# EAGLE design core v1 (EAGLE 6.1)

## Sheet 1 of 3
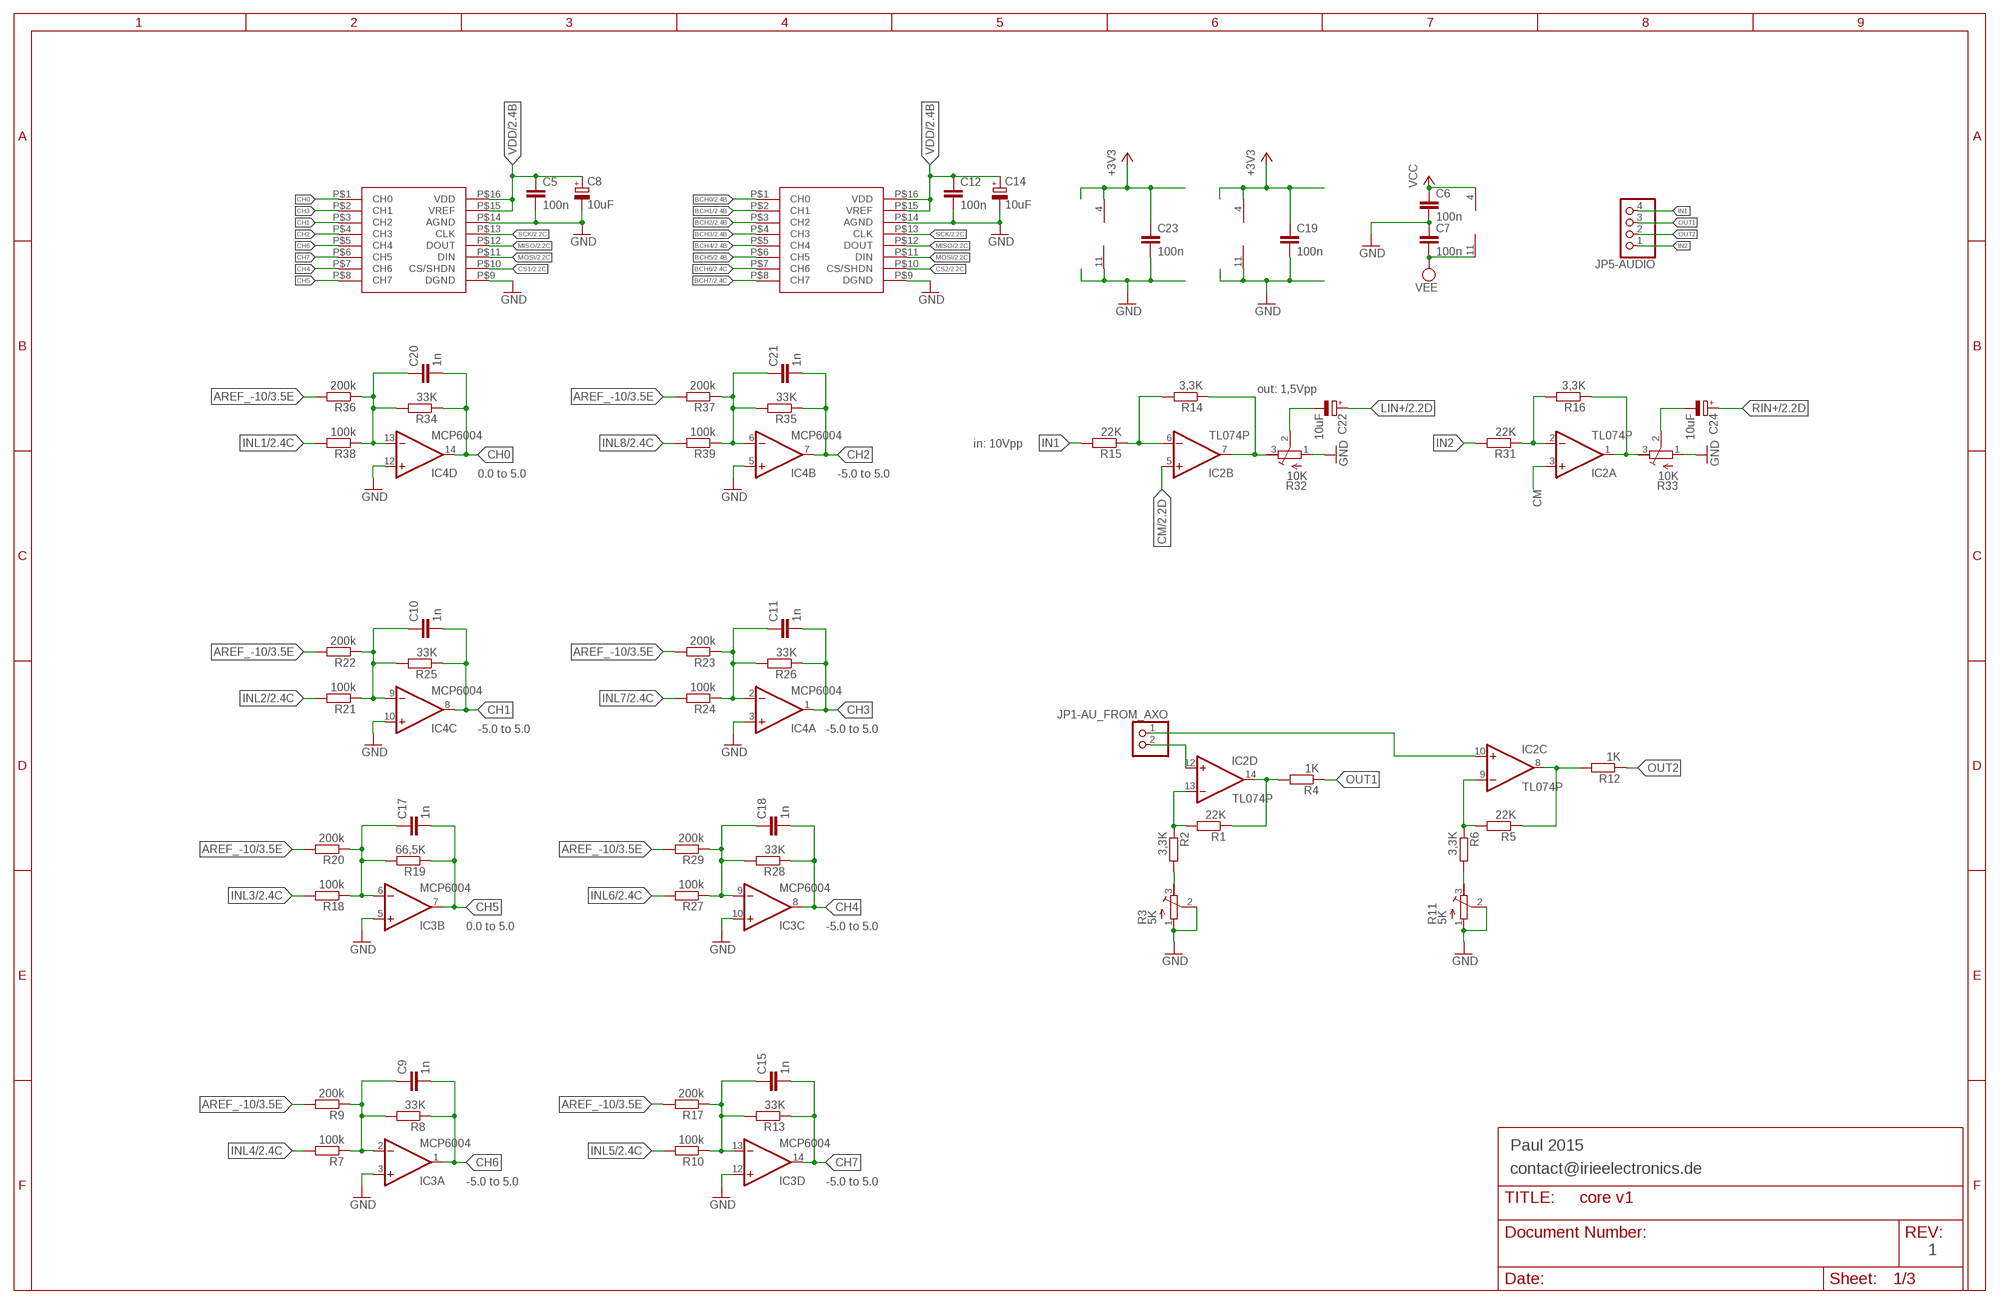
[diagram p0: schematic, sheet 1]

### Parts
C5  100n  C-EU025-025X050  [C025-025X050]
C6  100n  C-EU025-025X050  [C025-025X050]
C7  100n  C-EU025-025X050  [C025-025X050]
C8  10uF  CPOL-EUE1.8-4  [E1,8-4]
C9  1n  C-EU050-025X075  [C050-025X075]
C10  1n  C-EU050-025X075  [C050-025X075]
C11  1n  C-EU050-025X075  [C050-025X075]
C12  100n  C-EU025-025X050  [C025-025X050]
C14  10uF  CPOL-EUE1.8-4  [E1,8-4]
C15  1n  C-EU050-025X075  [C050-025X075]
C17  1n  C-EU050-025X075  [C050-025X075]
C18  1n  C-EU050-025X075  [C050-025X075]
C19  100n  C-EU025-025X050  [C025-025X050]
C20  1n  C-EU050-025X075  [C050-025X075]
C21  1n  C-EU050-025X075  [C050-025X075]
C22  10uF  CPOL-EUE1.8-4  [E1,8-4]
C23  100n  C-EU025-025X050  [C025-025X050]
C24  10uF  CPOL-EUE1.8-4  [E1,8-4]
IC2  TL074P  [DIL14]
IC3  MCP6004  TL074P  [DIL14]
IC4  MCP6004  TL074P  [DIL14]
JP1-AU_FROM_AXO  PINHD-1X2/90  [1X02/90]
JP5-AUDIO  PINHD-1X4_2.54  [1X04]
R1  22K  R-EU_0207/10  [0207/10]
R2  3,3K  R-EU_0207/12  [0207/12]
R3  5K  R-TRIMM3296P  [RTRIM3296P]
R4  1K  R-EU_0207/7  [0207/7]
R5  22K  R-EU_0207/7  [0207/7]
R6  3,3K  R-EU_0207/7  [0207/7]
R7  100k  R-EU_0207/7  [0207/7]
R8  33K  R-EU_0207/7  [0207/7]
R9  200k  R-EU_0207/10  [0207/10]
R10  100k  R-EU_0207/7  [0207/7]
R11  5K  R-TRIMM3296P  [RTRIM3296P]
R12  1K  R-EU_0207/10  [0207/10]
R13  33K  R-EU_0207/7  [0207/7]
R14  3,3K  R-EU_0207/7  [0207/7]
R15  22K  R-EU_0207/7  [0207/7]
R16  3,3K  R-EU_0207/7  [0207/7]
R17  200k  R-EU_0207/7  [0207/7]
R18  100k  R-EU_0207/7  [0207/7]
R19  66,5K  R-EU_0207/7  [0207/7]
R20  200k  R-EU_0207/10  [0207/10]
R21  100k  R-EU_0207/7  [0207/7]
R22  200k  R-EU_0207/7  [0207/7]
R23  200k  R-EU_0207/7  [0207/7]
R24  100k  R-EU_0207/10  [0207/10]
R25  33K  R-EU_0207/7  [0207/7]
R26  33K  R-EU_0207/7  [0207/7]
R27  100k  R-EU_0207/7  [0207/7]
R28  33K  R-EU_0207/7  [0207/7]
R29  200k  R-EU_0207/7  [0207/7]
R31  22K  R-EU_0207/7  [0207/7]
R32  10K  R-TRIMM3296P  [RTRIM3296P]
R33  10K  R-TRIMM3296P  [RTRIM3296P]
R34  33K  R-EU_0207/7  [0207/7]
R35  33K  R-EU_0207/7  [0207/7]
R36  200k  R-EU_0207/7  [0207/7]
R37  200k  R-EU_0207/7  [0207/7]
R38  100k  R-EU_0207/7  [0207/7]
R39  100k  R-EU_0207/7  [0207/7]
U$4  MCP3208_DIP  [MCP2308]
U$5  MCP3208_DIP  [MCP2308]

### Nets
+3V3: C19.1 C23.1 IC3.4(P:V+) IC4.4(P:V+) ; also sheet 2
AREF_-10: R9.2 R17.2 R20.2 R22.2 R23.2 R29.2 R36.2 R37.2 ; also sheet 3
BCH0: U$5.P$1(CH0) ; also sheet 2
BCH1: U$5.P$2(CH1) ; also sheet 2
BCH2: U$5.P$3(CH2) ; also sheet 2
BCH3: U$5.P$4(CH3) ; also sheet 2
BCH4: U$5.P$5(CH4) ; also sheet 2
BCH5: U$5.P$6(CH5) ; also sheet 2
BCH6: U$5.P$7(CH6) ; also sheet 2
BCH7: U$5.P$8(CH7) ; also sheet 2
CH0: C20.2 IC4.14(D:OUT) R34.1 U$4.P$1(CH0)
CH1: C10.2 IC4.8(C:OUT) R25.1 U$4.P$3(CH2)
CH2: C21.2 IC4.7(B:OUT) R35.1 U$4.P$4(CH3)
CH3: C11.2 IC4.1(A:OUT) R26.1 U$4.P$2(CH1)
CH4: C18.2 IC3.8(C:OUT) R28.1 U$4.P$7(CH6)
CH5: C17.2 IC3.7(B:OUT) R19.1 U$4.P$8(CH7)
CH6: C9.2 IC3.1(A:OUT) R8.1 U$4.P$5(CH4)
CH7: C15.2 IC3.14(D:OUT) R13.1 U$4.P$6(CH5)
CM: IC2.3(A:+IN) IC2.5(B:+IN) ; also sheet 2
CS1: U$4.P$10(CS/SHDN) ; also sheet 2
CS2: U$5.P$10(CS/SHDN) ; also sheet 2
GND: C5.2 C6.2 C7.1 C8.- C12.2 C14.- C19.2 C23.2 IC3.3(A:+IN) IC3.5(B:+IN) IC3.10(C:+IN) IC3.11(P:V-) IC3.12(D:+IN) IC4.3(A:+IN) IC4.5(B:+IN) IC4.10(C:+IN) IC4.11(P:V-) IC4.12(D:+IN) R3.1(E) R3.2(S) R11.1(E) R11.2(S) R32.1(E) R33.1(E) U$4.P$9(DGND) U$4.P$14(AGND) U$5.P$9(DGND) U$5.P$14(AGND) ; also sheet 2,3
IN1: JP5-AUDIO.4 R15.2
IN2: JP5-AUDIO.1 R31.2
INL1: R38.2 ; also sheet 2
INL2: R21.2 ; also sheet 2
INL3: R18.2 ; also sheet 2
INL4: R7.2 ; also sheet 2
INL5: R10.2 ; also sheet 2
INL6: R27.2 ; also sheet 2
INL7: R24.2 ; also sheet 2
INL8: R39.2 ; also sheet 2
LIN+: C22.+ ; also sheet 2
MISO: U$4.P$12(DOUT) U$5.P$12(DOUT) ; also sheet 2
MOSI: U$4.P$11(DIN) U$5.P$11(DIN) ; also sheet 2
N$2: C10.1 IC4.9(C:-IN) R21.1 R22.1 R25.2
N$4: R2.2 R3.3(A)
N$5: C11.1 IC4.2(A:-IN) R23.1 R24.1 R26.2
N$6: IC2.13(D:-IN) R1.2 R2.1
N$7: IC2.14(D:OUT) R1.1 R4.2
N$8: C22.- R32.2(S)
N$9: R6.2 R11.3(A)
N$10: IC2.9(C:-IN) R5.2 R6.1
N$11: C20.1 IC4.13(D:-IN) R34.2 R36.1 R38.1
N$12: IC2.8(C:OUT) R5.1 R12.2
N$13: IC2.10(C:+IN) JP1-AU_FROM_AXO.1
N$14: IC2.12(D:+IN) JP1-AU_FROM_AXO.2
N$15: C21.1 IC4.6(B:-IN) R35.2 R37.1 R39.1
N$16: C24.- R33.2(S)
N$17: IC2.6(B:-IN) R14.2 R15.1
N$18: C9.1 IC3.2(A:-IN) R7.1 R8.2 R9.1
N$19: IC2.7(B:OUT) R14.1 R32.3(A)
N$20: C15.1 IC3.13(D:-IN) R10.1 R13.2 R17.1
N$21: IC2.2(A:-IN) R16.2 R31.1
N$22: C17.1 IC3.6(B:-IN) R18.1 R19.2 R20.1
N$23: IC2.1(A:OUT) R16.1 R33.3(A)
N$24: C18.1 IC3.9(C:-IN) R27.1 R28.2 R29.1
OUT1: JP5-AUDIO.3 R4.1
OUT2: JP5-AUDIO.2 R12.1
RIN+: C24.+ ; also sheet 2
SCK: U$4.P$13(CLK) U$5.P$13(CLK) ; also sheet 2
VCC: C6.1 IC2.4(P:V+) ; also sheet 3
VDD: C5.1 C8.+ C12.1 C14.+ U$4.P$15(VREF) U$4.P$16(VDD) U$5.P$15(VREF) U$5.P$16(VDD) ; also sheet 2
VEE: C7.2 IC2.11(P:V-) ; also sheet 3

### Notes on the sheet
- out: 1,5Vpp
- in: 10Vpp
- 0.0 to 5.0 | -5.0 to 5.0
- -5.0 to 5.0 | -5.0 to 5.0
- 0.0 to 5.0 | -5.0 to 5.0
- Paul 2015
- contact@irieelectronics.de
- -5.0 to 5.0 | -5.0 to 5.0
- 1

## Sheet 2 of 3
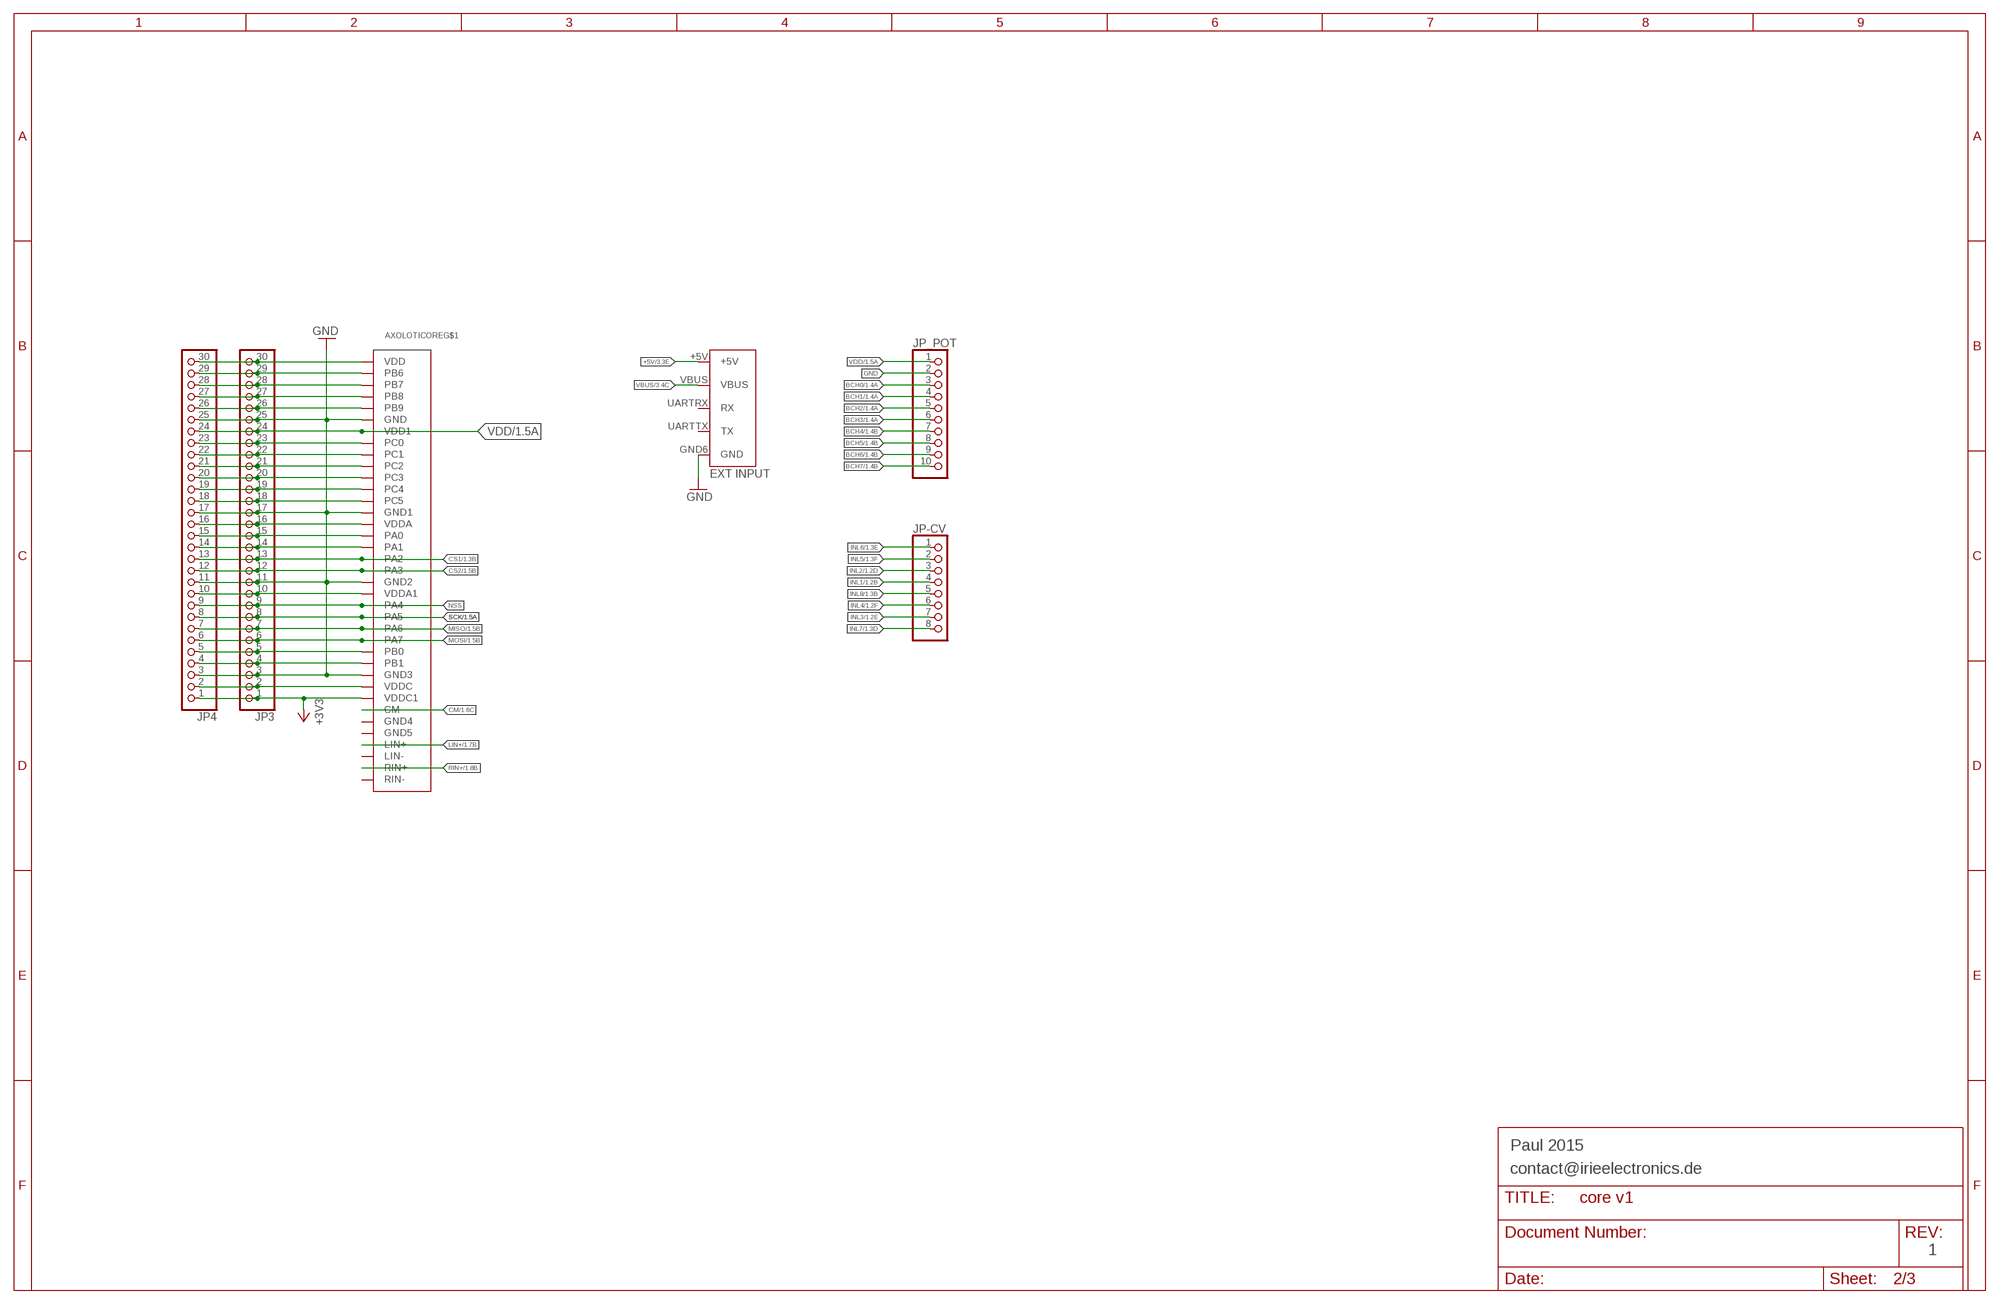
[diagram p1: schematic, sheet 2]

### Parts
AXOLOTICORE  AXOLOTI-CORE  [AXOLOTI-CORE]
JP3  PINHD-1X30  [1X30]
JP4  PINHD-1X30  [1X30]
JP-CV  PINHD-1X8_2.54  [1X08]
JP_POT  PINHD-1X10  [1X10]

### Nets
+3V3: AXOLOTICORE.VDDC1 JP3.1 JP4.1 ; also sheet 1
+5V: AXOLOTICORE.+5V ; also sheet 3
BCH0: JP_POT.3 ; also sheet 1
BCH1: JP_POT.4 ; also sheet 1
BCH2: JP_POT.5 ; also sheet 1
BCH3: JP_POT.6 ; also sheet 1
BCH4: JP_POT.7 ; also sheet 1
BCH5: JP_POT.8 ; also sheet 1
BCH6: JP_POT.9 ; also sheet 1
BCH7: JP_POT.10 ; also sheet 1
CM: AXOLOTICORE.CM ; also sheet 1
CS1: AXOLOTICORE.PA2 JP3.13 JP4.13 ; also sheet 1
CS2: AXOLOTICORE.PA3 JP3.12 JP4.12 ; also sheet 1
GND: AXOLOTICORE.GND AXOLOTICORE.GND1 AXOLOTICORE.GND2(GND3) AXOLOTICORE.GND3(GND2) AXOLOTICORE.GND6(GND) JP3.3 JP3.11 JP3.17 JP3.25 JP4.3 JP4.11 JP4.17 JP4.25 JP_POT.2 ; also sheet 1,3
INL1: JP-CV.4 ; also sheet 1
INL2: JP-CV.3 ; also sheet 1
INL3: JP-CV.7 ; also sheet 1
INL4: JP-CV.6 ; also sheet 1
INL5: JP-CV.2 ; also sheet 1
INL6: JP-CV.1 ; also sheet 1
INL7: JP-CV.8 ; also sheet 1
INL8: JP-CV.5 ; also sheet 1
LIN+: AXOLOTICORE.LIN+ ; also sheet 1
MISO: AXOLOTICORE.PA6 JP3.7 JP4.7 ; also sheet 1
MOSI: AXOLOTICORE.PA7 JP3.6 JP4.6 ; also sheet 1
N$26: AXOLOTICORE.PB1 JP3.4 JP4.4
N$27: AXOLOTICORE.PB0 JP3.5 JP4.5
N$29: AXOLOTICORE.VDDC JP3.2 JP4.2
N$32: AXOLOTICORE.VDDA1 JP3.10 JP4.10
N$36: AXOLOTICORE.PA1 JP3.14 JP4.14
N$37: AXOLOTICORE.PA0 JP3.15 JP4.15
N$38: AXOLOTICORE.VDDA JP3.16 JP4.16
N$40: AXOLOTICORE.PC5 JP3.18 JP4.18
N$41: AXOLOTICORE.PC4 JP3.19 JP4.19
N$42: AXOLOTICORE.PC3 JP3.20 JP4.20
N$43: AXOLOTICORE.PC2 JP3.21 JP4.21
N$44: AXOLOTICORE.PC1 JP3.22 JP4.22
N$45: AXOLOTICORE.PC0 JP3.23 JP4.23
N$48: AXOLOTICORE.PB9 JP3.26 JP4.26
N$49: AXOLOTICORE.PB8 JP3.27 JP4.27
N$50: AXOLOTICORE.PB7 JP3.28 JP4.28
N$51: AXOLOTICORE.PB6 JP3.29 JP4.29
NSS: AXOLOTICORE.PA4 JP3.9 JP4.9
RIN+: AXOLOTICORE.RIN+ ; also sheet 1
SCK: AXOLOTICORE.PA5 JP3.8 JP4.8 ; also sheet 1
VBUS: AXOLOTICORE.VBUS ; also sheet 3
VDD: AXOLOTICORE.VDD1 JP3.24 JP4.24 JP_POT.1 ; also sheet 1
VDD+: AXOLOTICORE.VDD JP3.30 JP4.30
Unconnected: AXOLOTICORE.GND4 AXOLOTICORE.GND5 AXOLOTICORE.LIN- AXOLOTICORE.RIN- AXOLOTICORE.UARTRX(RX) AXOLOTICORE.UARTTX(TX)

### Notes on the sheet
- Paul 2015
- contact@irieelectronics.de
- 1

## Sheet 3 of 3
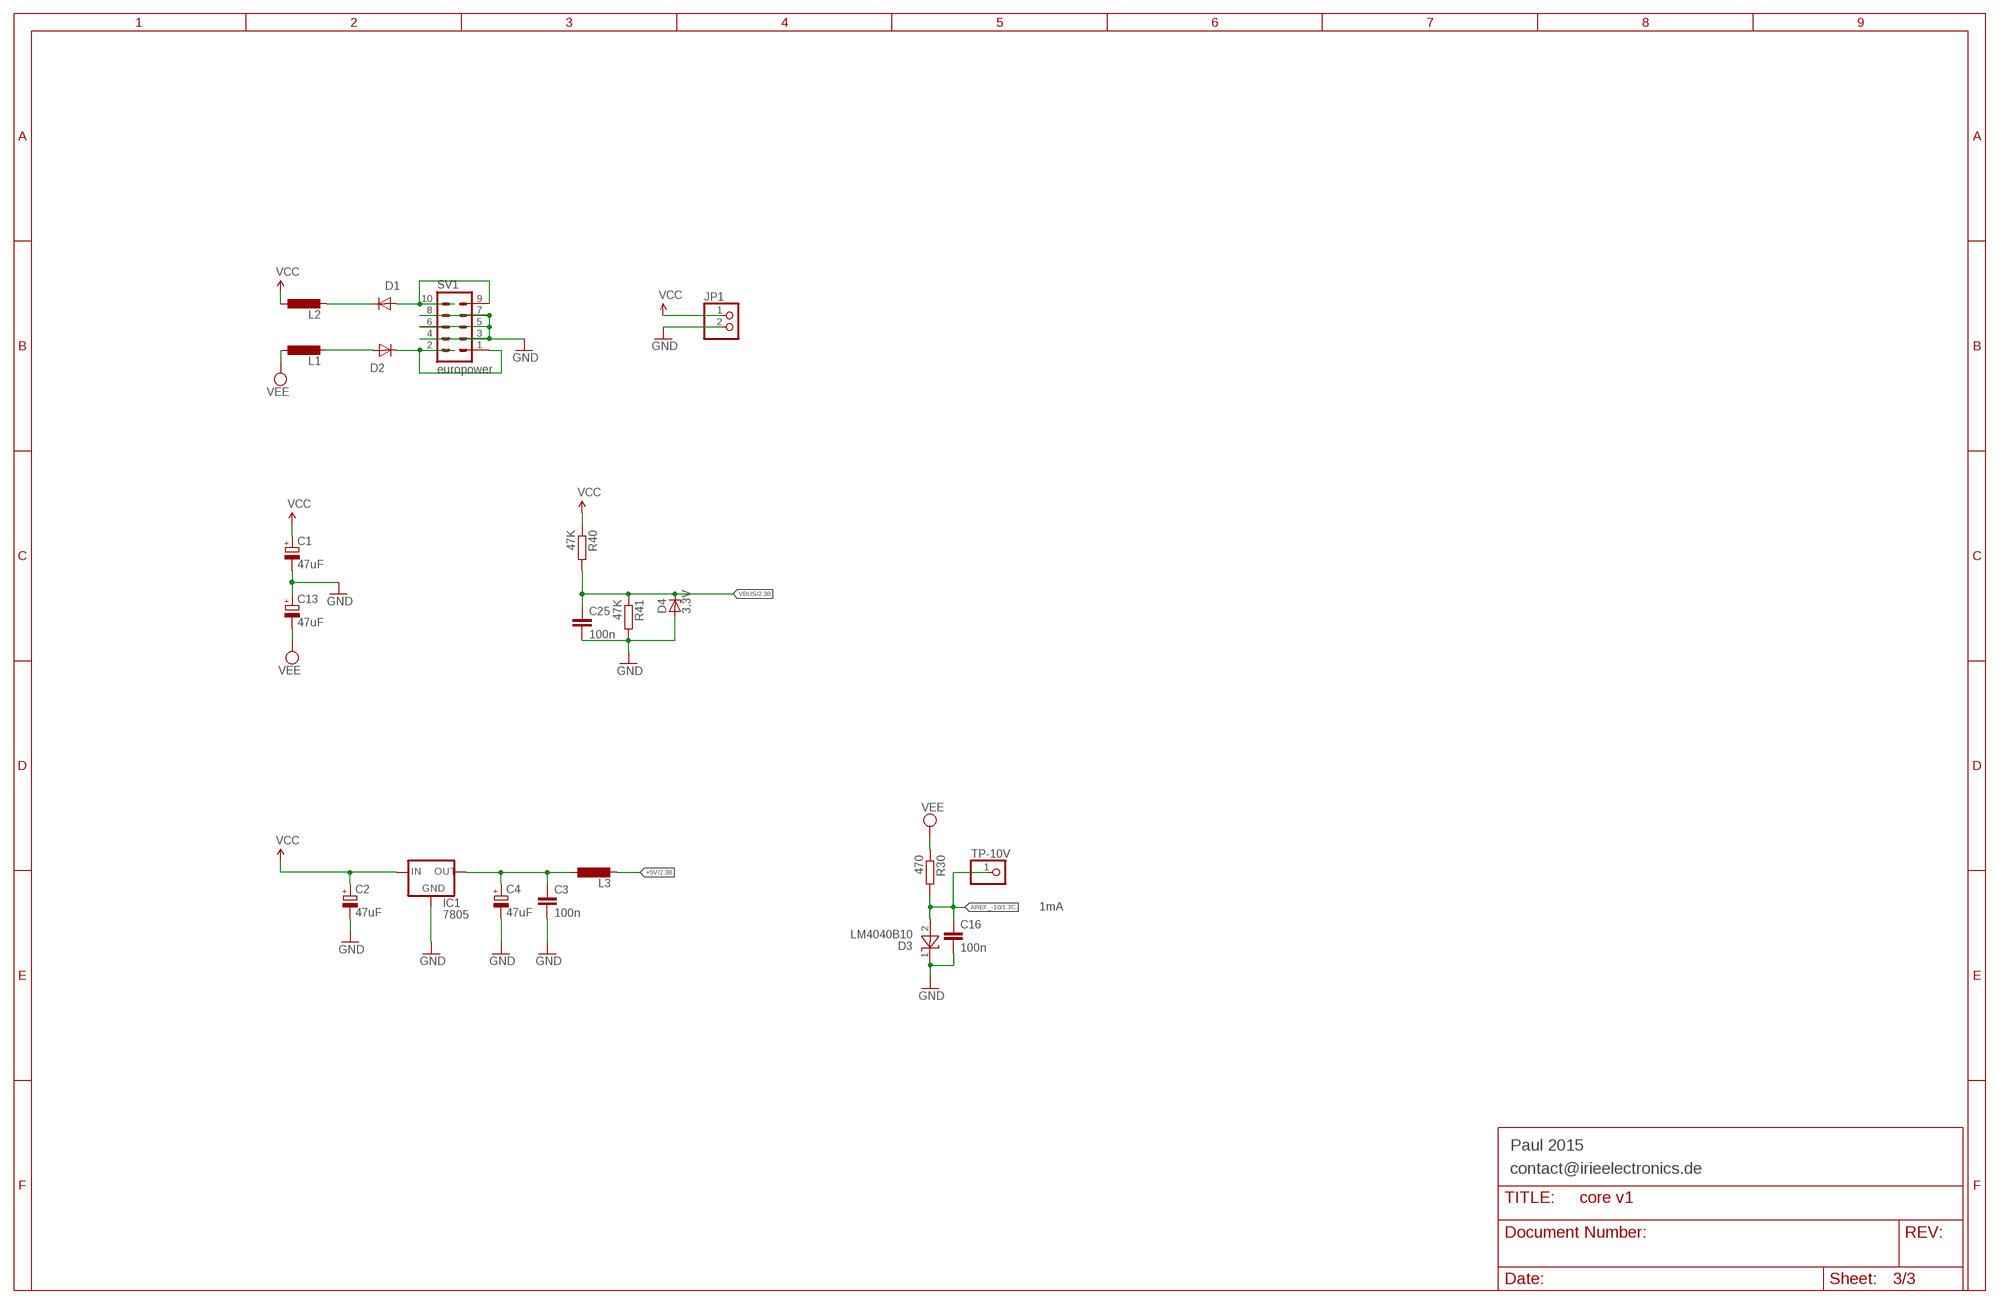
[diagram p2: schematic, sheet 3]

### Parts
C1  47uF  CPOL-EUE2-5  [E2-5]
C2  47uF  CPOL-EUE2-5  [E2-5]
C3  100n  C-EU025-025X050  [C025-025X050]
C4  47uF  CPOL-EUE2.5-5  [E2,5-5]
C13  47uF  CPOL-EUE2-5  [E2-5]
C16  100n  C-EU025-025X050  [C025-025X050]
C25  100n  C-EU025-025X050  [C025-025X050]
D1  1N5819HW  1N4148DO35-10  [DO35-10]
D2  1N5819HW  1N4148DO35-10  [DO35-10]
D3  LM4040B10  LM4040DIP  [TO-92]
D4  3,3V  1N821  [DO35Z10]
IC1  7805  78XXS  [78XXS]
JP1  PINHD-1X2  [1X02]
L1  L-EU0207/10  [0207/10]
L2  L-EU0207/10  [0207/10]
L3  L-EU0207/10  [0207/10]
R30  470  R-EU_0207/12  [0207/12]
R40  47K  R-EU_0207/7  [0207/7]
R41  47K  R-EU_0207/7  [0207/7]
SV1  europower  EURO_POWER_HEADERFAT_PADS  [EURO_PWR_HEADER_FAT]
TP-10V  PINHD-1X1_2.54  [1X01]

### Nets
+5V: L3.2 ; also sheet 2
+5V_RAW: C3.1 C4.+ IC1.OUT L3.1
AREF_-10: C16.1 D3.2(A) R30.2 TP-10V.1 ; also sheet 1
GND: C1.- C2.- C3.2 C4.- C13.+ C16.2 C25.2 D3.1(C) D4.A IC1.GND JP1.2 R41.2 SV1.3 SV1.4 SV1.5 SV1.6 SV1.7 SV1.8 ; also sheet 1,2
N$1: D1.C L2.2
N$3: D2.A L1.2
N$56: D1.A SV1.9 SV1.10
N$64: D2.C SV1.1 SV1.2
VBUS: C25.1 D4.C R40.2 R41.1 ; also sheet 2
VCC: C1.+ C2.+ IC1.IN JP1.1 L2.1 R40.1 ; also sheet 1
VEE: C13.- L1.1 R30.1 ; also sheet 1

### Notes on the sheet
- 1mA
- Paul 2015
- contact@irieelectronics.de

## Library data of the parts
AXOLOTICORE = axoloti core:AXOLOTI-CORE
C1 C2 C4 C8 C13 C14 C22 C24 = resistor-mod:CPOL-EU: POLARIZED CAPACITOR, European symbol
C3 C5-C7 C9-C12 C15-C21 C23 C25 = resistor-mod:C-EU: CAPACITOR, European symbol
D1 D2 = diode:1N4148: DIODE high speed (Philips)
D3 = GuShH:LM4040
D4 = diode:1N821: Reference DIODE temperature compensated, 6,2 V
IC1 = v-reg:78XXS: VOLTAGE REGULATOR
IC2-IC4 = linear:TL074: OP AMP
JP1 JP1-AU_FROM_AXO = pinhead:PINHD-1X2: PIN HEADER
JP3 JP4 = pinhead:PINHD-1X30: PIN HEADER
JP5-AUDIO = pinhead 2:PINHD-1X4: PIN HEADER
JP-CV = pinhead 2:PINHD-1X8: PIN HEADER
JP_POT = pinhead:PINHD-1X10: PIN HEADER
L1-L3 = resistor-mod:L-EU: INDUCTOR, European symbol
R1 R2 R4-R10 R12-R31 R34-R41 = resistor-mod:R-EU_: RESISTOR, European symbol
R3 R11 R32 R33 = resistor-mod:R-TRIMM: Trimm resistor
SV1 = MusicThingModular:EURO_POWER_HEADER: Power Header 10 pin power header for Eurorack Power Supplies Variants with fatter pads for easier soldering, and the LOCK variant which has 5mil offset pins to hold the component in place before soldering
TP-10V = pinhead 2:PINHD-1X1: PIN HEADER
U$4 U$5 = mcp2308:MCP3208_DIP: MCP3208 DIP

## Board
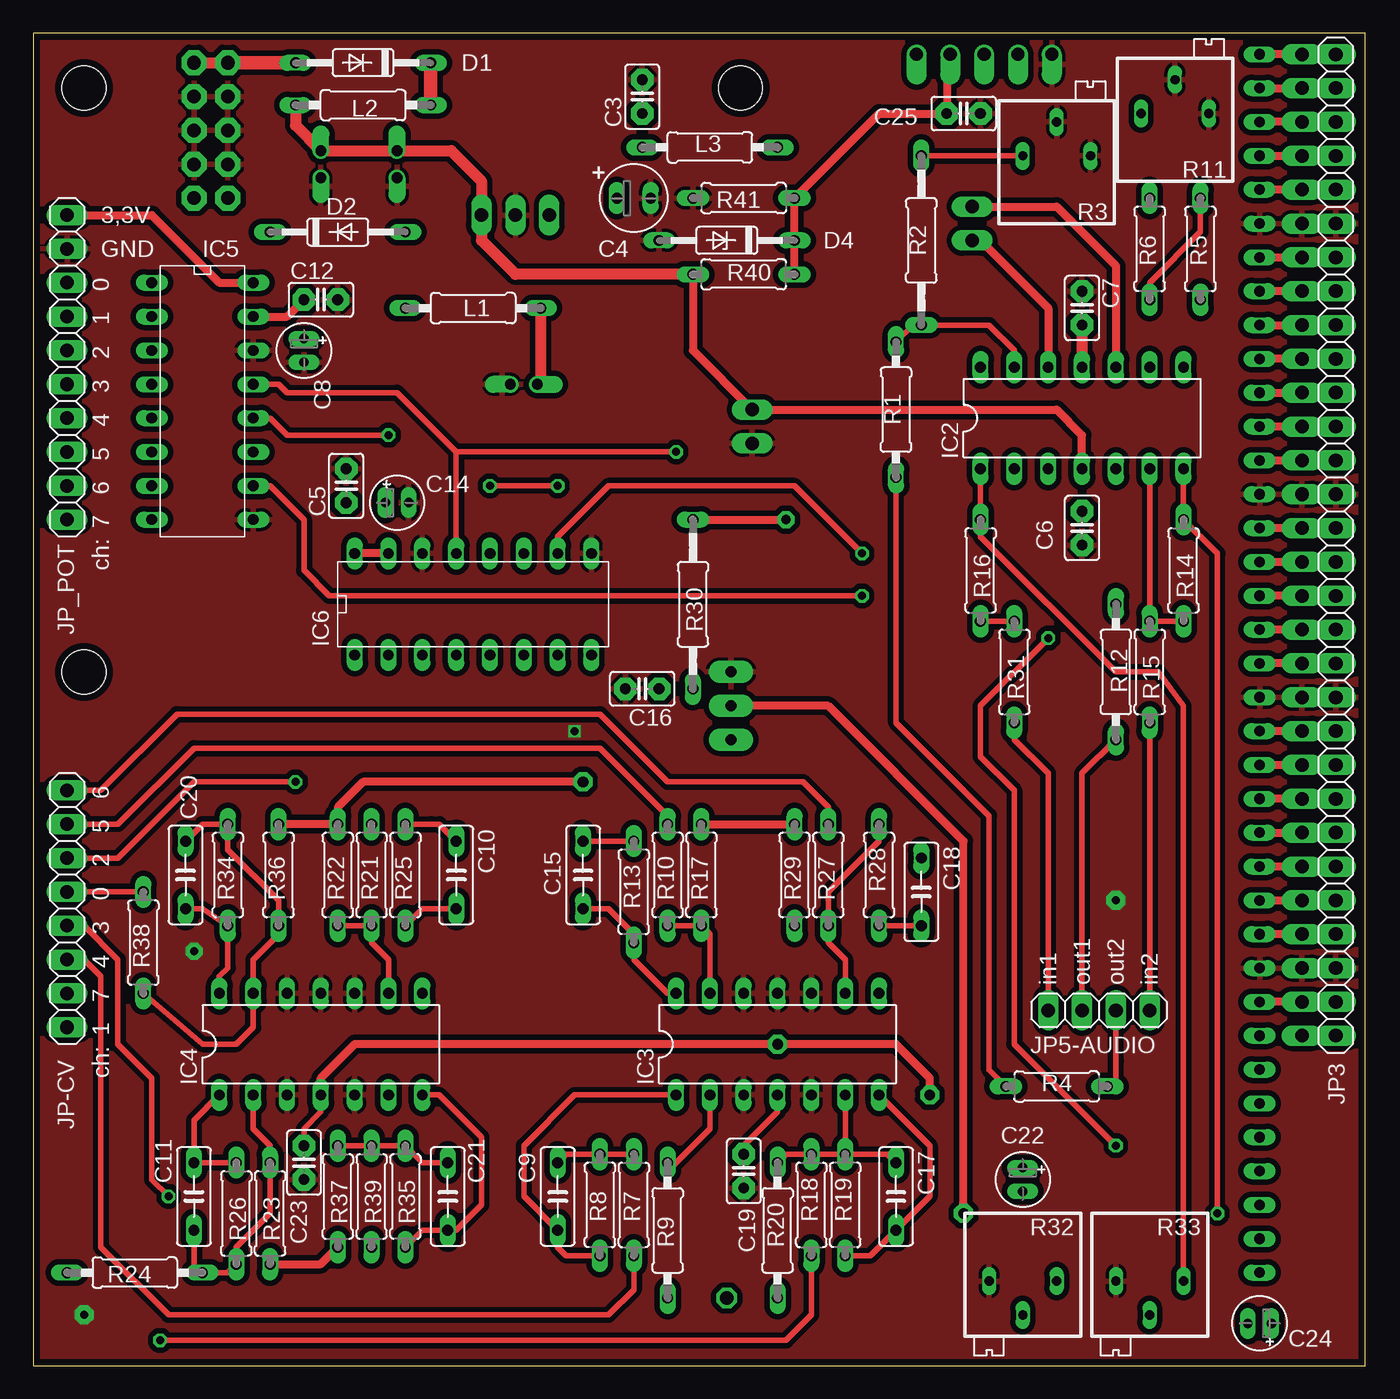
[diagram p3: board, top side]
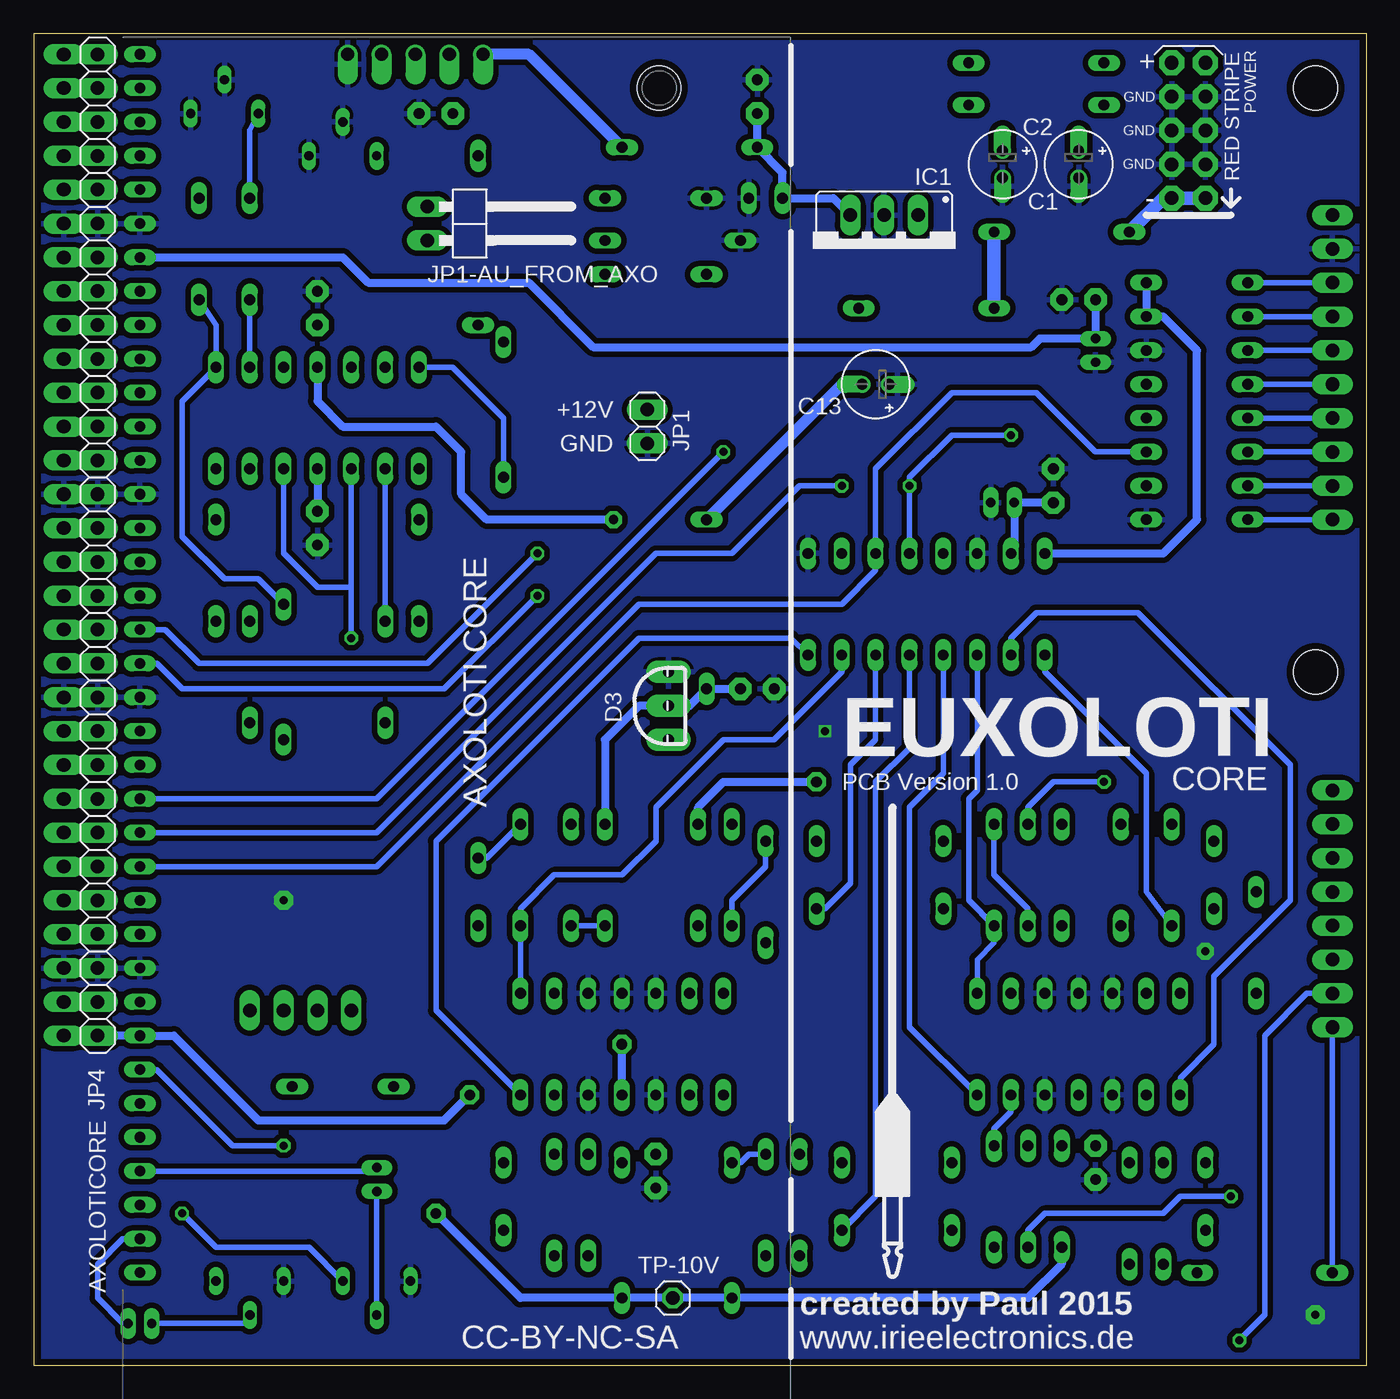
[diagram p4: board, bottom side, seen from below]

Size 100 x 100 mm. Coordinates in mm from the lower left corner, seen from the top.
Outline: 0,0 100,0 100,100 0,100 0,0
Copper layers (1*2*15*16): Top 0.035mm / dielectric 0.2mm / Route2 0.035mm / dielectric 1.2mm / Route15 0.035mm / dielectric 0.2mm / Bottom 0.035mm
Design rules: minimum track width 6mil, minimum drill 12mil, track to track 6mil, track to pad 8mil, pad to pad 12mil, via to via 6mil, smd to smd 0mil, copper to edge 20mil, drill to drill 10mil, minimum pad ring 6mil, minimum via ring 6mil, stop-mask expansion 0mil, vias tented up to drill 100mil, thermal gap 10mil
Holes 3.3 mm at 3.81,52.07 3.81,95.89 53.1,95.89

### Footprints (pad centres in the part's own frame; a part is rotated, then mirrored left to right if it is on the bottom)
AXOLOTI-CORE = drill 1 offset: +5V 107.315,23.13; GND6 107.315,33.29; UARTRX 107.315,28.21; UARTTX 107.315,30.75; VBUS 107.315,25.67 | drill 0.8 long: CM 31.115,48.895; GND 94.615,48.895; GND1 74.295,48.895; GND2 38.735,48.895; GND3 59.055,48.895; GND4 28.575,48.895; GND5 26.035,48.895; LIN+ 23.495,48.895; LIN- 20.955,48.895; PA0 69.215,48.895; PA1 66.675,48.895; PA2 64.135,48.895; PA3 61.595,48.895; PA4 53.975,48.895; PA5 51.435,48.895; PA6 48.895,48.895; PA7 46.355,48.895; PB0 43.815,48.895; PB1 41.275,48.895; PB6 104.775,48.895; PB7 102.235,48.895; PB8 99.695,48.895; PB9 97.155,48.895; PC0 89.535,48.895; PC1 86.995,48.895; PC2 84.455,48.895; PC3 81.915,48.895; PC4 79.375,48.895; PC5 76.835,48.895; RIN+ 18.415,48.895; RIN- 15.875,48.895; VDD 107.315,48.895; VDD1 92.075,48.895; VDDA 71.755,48.895; VDDA1 56.515,48.895; VDDC 36.195,48.895; VDDC1 33.655,48.895
E2-5 = drill 0.813 pad 1.27 offset: + -1.016,0; - 1.016,0
C025-025X050 = drill 0.813 pad 1.676 octagon: 1 -1.27,0; 2 1.27,0
E2,5-5 = drill 0.813 long: + -1.27,0; - 1.27,0
E1,8-4 = drill 0.711 pad 1.168 long: + -0.889,0; - 0.889,0
C050-025X075 = drill 0.813 long: 1 -2.54,0; 2 2.54,0
DO35-10 = drill 0.813 long: A 5.08,0; C -5.08,0
TO-92 = drill 0.813 pad 1.676 long: 1 2.54,0.318; 2 0,0.318; 3 -2.54,0.318
DO35Z10 = drill 0.813 long: A 5.08,0; C -5.08,0
78XXS = drill 1.016 long: GND 0,-2.54; IN -2.54,-2.54; OUT 2.54,-2.54
DIL14 = drill 0.813 long: 1 -7.62,-3.81; 2 -5.08,-3.81; 3 -2.54,-3.81; 4 0,-3.81; 5 2.54,-3.81; 6 5.08,-3.81; 7 7.62,-3.81; 8 7.62,3.81; 9 5.08,3.81; 10 2.54,3.81; 11 0,3.81; 12 -2.54,3.81; 13 -5.08,3.81; 14 -7.62,3.81
1X02 = drill 1.016 long: 1 -1.27,0; 2 1.27,0
1X02/90 = drill 1.016 long: 1 -1.27,-3.81; 2 1.27,-3.81
1X30 = drill 1.016 long: 1 -36.83,0; 2 -34.29,0; 3 -31.75,0; 4 -29.21,0; 5 -26.67,0; 6 -24.13,0; 7 -21.59,0; 8 -19.05,0; 9 -16.51,0; 10 -13.97,0; 11 -11.43,0; 12 -8.89,0; 13 -6.35,0; 14 -3.81,0; 15 -1.27,0; 16 1.27,0; 17 3.81,0; 18 6.35,0; 19 8.89,0; 20 11.43,0; 21 13.97,0; 22 16.51,0; 23 19.05,0; 24 21.59,0; 25 24.13,0; 26 26.67,0; 27 29.21,0; 28 31.75,0; 29 34.29,0; 30 36.83,0
1X04 = drill 1.016 long: 1 -3.81,0; 2 -1.27,0; 3 1.27,0; 4 3.81,0
1X08 = drill 1.016 long: 1 -8.89,0; 2 -6.35,0; 3 -3.81,0; 4 -1.27,0; 5 1.27,0; 6 3.81,0; 7 6.35,0; 8 8.89,0
1X10 = drill 1.016 long: 1 -11.43,0; 2 -8.89,0; 3 -6.35,0; 4 -3.81,0; 5 -1.27,0; 6 1.27,0; 7 3.81,0; 8 6.35,0; 9 8.89,0; 10 11.43,0
0207/10 = drill 0.813 long: 1 -5.08,0; 2 5.08,0
0207/12 = drill 0.813 long: 1 -6.35,0; 2 6.35,0
RTRIM3296P = drill 0.7 long: 1 0,-2.54; 2 2.54,0; 3 0,2.54
0207/7 = drill 0.813 long: 1 -3.81,0; 2 3.81,0
EURO_PWR_HEADER_FAT = drill 1.016 pad 1.88 octagon: 1 -5.08,-1.27; 2 -5.08,1.27; 3 -2.54,-1.27; 4 -2.54,1.27; 5 0,-1.27; 6 0,1.27; 7 2.54,-1.27; 8 2.54,1.27; 9 5.08,-1.27; 10 5.08,1.27
1X01 = drill 1.016 octagon: 1 0,0
MCP2308 = drill 0.8 long: P$1 -3.81,7.62; P$2 -3.81,5.08; P$3 -3.81,2.54; P$4 -3.81,0; P$5 -3.81,-2.54; P$6 -3.81,-5.08; P$7 -3.81,-7.62; P$8 -3.81,-10.16; P$9 3.81,-10.16; P$10 3.81,-7.62; P$11 3.81,-5.08; P$12 3.81,-2.54; P$13 3.81,0; P$14 3.81,2.54; P$15 3.81,5.08; P$16 3.81,7.62

### Placement (x,y rotation side)
AXOLOTICORE  43.18,-8.89 90 bottom
C1  27.3,90.17 270 bottom
C2  21.59,90.17 270 bottom
C3  45.72,95.25 90 top
C4  45.09,87.63 0 top
C5  23.5,66.04 90 top
C6  78.74,62.87 270 top
C7  78.74,79.38 270 top
C8  20.32,76.2 270 top
C9  39.37,12.7 270 top
C10  31.75,36.83 270 top
C11  12.06,12.7 90 top
C12  21.59,80.01 0 top
C13  36.83,73.66 180 bottom
C14  27.3,64.77 0 top
C15  41.27,36.83 270 top
C16  45.72,50.8 180 top
C17  64.77,12.7 270 top
C18  66.67,35.56 270 top
C19  53.34,14.61 270 top
C20  11.43,36.83 270 top
C21  31.11,12.7 270 top
C22  74.3,13.97 270 top
C23  20.32,15.24 270 top
C24  92.08,3.17 180 top
C25  69.85,93.98 0 top
D1  24.77,97.79 180 top
D2  22.86,85.09 0 top
D3  52.07,49.53 90 bottom
D4  52.07,84.45 180 top
IC1  36.2,83.82 180 bottom
IC2  78.74,71.12 0 top
IC3  55.88,24.13 0 top
IC4  21.59,24.13 0 top
JP1  53.98,70.48 270 bottom
JP1-AU_FROM_AXO  66.67,85.72 270 bottom
JP3  97.79,61.59 90 top
JP4  95.25,61.59 90 bottom
JP5-AUDIO  80.01,26.67 0 top
JP-CV  2.54,34.29 270 top
JP_POT  2.54,74.93 270 top
L1  33.02,79.38 180 top
L2  24.77,94.61 0 top
L3  50.8,91.44 0 top
R1  64.77,71.75 90 top
R2  66.67,84.45 90 top
R3  76.83,90.81 90 top
R4  76.83,20.95 180 top
R5  87.63,83.82 90 top
R6  83.82,83.82 90 top
R7  45.09,12.06 270 top
R8  42.55,12.06 90 top
R9  47.62,10.16 270 top
R10  47.62,36.83 90 top
R11  85.72,93.98 90 top
R12  81.28,52.07 90 top
R13  45.09,35.56 90 top
R14  86.36,59.69 270 top
R15  83.82,52.07 270 top
R16  71.12,59.69 270 top
R17  50.16,36.83 90 top
R18  58.42,12.06 270 top
R19  60.96,12.06 90 top
R20  55.88,10.16 270 top
R21  25.4,36.83 90 top
R22  22.86,36.83 90 top
R23  17.78,11.43 270 top
R24  7.62,6.99 180 top
R25  27.94,36.83 90 top
R26  15.24,11.43 270 top
R27  59.69,36.83 90 top
R28  63.5,36.83 90 top
R29  57.15,36.83 90 top
R30  49.53,57.15 270 top
R31  73.66,52.07 270 top
R32  74.3,6.35 270 top
R33  83.82,6.35 270 top
R34  14.61,36.83 90 top
R35  27.94,12.7 90 top
R36  18.41,36.83 90 top
R37  22.86,12.7 270 top
R38  8.26,31.75 90 top
R39  25.4,12.7 270 top
R40  53.34,81.92 0 top
R41  53.34,87.63 180 top
SV1  13.34,92.71 90 bottom
TP-10V  52.07,5.08 0 bottom
U$1  [KLINKENBILD]  35.56,16.51 0 bottom
U$4  31.75,57.15 90 top
U$5  12.7,73.66 0 top

### Tracks (layer width: path | path; a pad name or v marks a point on that pad's centre or on a via)
+3V3  (via drill 0.8 pad 1.42)
  Top 0.406: IC4.4 21.59,19.05 20.32,17.78 C23.1 | IC3.4 55.88,19.05 53.34,16.51 C19.1
  Top 0.61: v67.31,20.32 67.31,21.59 64.77,24.13 v55.88,24.13 24.13,24.13 21.59,21.59 IC4.4
  Bottom 0.61: v67.31,20.32 69.22,18.41 83.19,18.41 89.53,24.77 AXOLOTICORE.VDDC1 JP4.1 JP3.1 | IC3.4 v55.88,24.13
+5V
  Bottom 0.813: L3.2 62.87,98.42 AXOLOTICORE.+5V
+5V_RAW
  Bottom 0.61: C3.1 L3.1 43.81,89.53 C4.+ 40.01,87.63 IC1.OUT
AREF_-10  (via drill 0.8 pad 1.42)
  Top 0.61: v69.85,11.43 69.85,39.37 59.69,49.53 D3.2 | v41.27,43.81 24.77,43.81 22.86,41.91 R22.2 R36.2 | R17.2 R29.2 | R23.2 21.59,7.62 R37.2
  Bottom 0.61: v69.85,11.43 63.5,5.08 R20.2 TP-10V.1 R9.2 25.4,5.08 22.86,7.62 R37.2 | R17.2 50.16,41.91 48.26,43.81 v41.27,43.81 | C16.1 R30.2 50.8,49.53 D3.2 54.61,49.53 57.15,46.99 R29.2
BCH0
  Bottom 0.406: U$5.P$1 JP_POT.3
BCH1
  Bottom 0.406: U$5.P$2 JP_POT.4
BCH2
  Bottom 0.406: U$5.P$3 JP_POT.5
BCH3
  Bottom 0.406: U$5.P$4 JP_POT.6
BCH4
  Bottom 0.406: U$5.P$5 JP_POT.7
BCH5
  Bottom 0.406: U$5.P$6 JP_POT.8
BCH6
  Bottom 0.406: U$5.P$7 JP_POT.9
BCH7
  Bottom 0.406: U$5.P$8 JP_POT.10
CH0
  Top 0.406: IC4.14 13.97,29.21 14.61,29.84 R34.1 12.7,34.29 C20.2
  Bottom 0.406: U$4.P$1 24.13,52.07 16.51,44.45 16.51,35.56 R34.1
CH1
  Top 0.406: C10.2 29.21,34.29 R25.1
  Bottom 0.406: U$4.P$3 29.21,43.18 29.84,42.55 29.84,34.92 R25.1 27.94,31.75 29.21,30.48 IC4.8
CH2
  Top 0.406: R35.1 29.21,10.16 C21.2 31.75,10.16 33.66,12.06 33.66,17.14 30.48,20.32 IC4.7
  Bottom 0.406: U$4.P$4 31.75,44.45 34.29,41.91 34.29,25.4 IC4.7
CH3
  Top 0.406: R26.1 C11.2 12.06,18.41 IC4.1
  Bottom 0.406: IC4.1 13.97,21.59 11.43,24.13 11.43,29.21 5.71,34.92 5.71,45.09 17.14,56.52 24.77,56.52 26.67,54.61 U$4.P$2
CH4
  Top 0.406: C18.2 R28.1
  Bottom 0.406: U$4.P$7 39.37,52.07 44.45,46.99 48.26,46.99 53.34,41.91 53.34,39.37 55.88,36.83 60.96,36.83 63.5,34.29 R28.1 IC3.8
CH5
  Top 0.406: IC3.7 67.31,16.51 67.31,12.7 C17.2 62.87,8.26 R19.1
  Bottom 0.406: U$4.P$8 43.18,54.61 54.61,54.61 69.85,39.37 69.85,26.67 IC3.7
CH6
  Top 0.406: R8.1 40.01,8.26 39.37,8.89 C9.2 36.83,12.7 36.83,16.51 40.64,20.32 IC3.1
  Bottom 0.406: U$4.P$5 34.29,46.35 36.83,43.81 36.83,12.7 C9.2
CH7
  Top 0.406: IC3.14 47.62,27.94 45.09,30.48 R13.1 45.09,32.38 43.18,34.29 C15.2
  Bottom 0.406: C15.2 40.64,34.29 38.73,36.2 38.73,45.09 36.83,46.99 U$4.P$6
CM  (via drill 0.6 pad 1.02)
  Top 0.406: v76.2,54.61 71.12,49.53 71.12,45.72 73.66,43.18 73.66,24.13 v81.28,16.51
  Bottom 0.406: AXOLOTICORE.CM 90.81,22.23 85.09,16.51 v81.28,16.51 | IC2.3 76.2,58.42 | 76.2,58.42 v76.2,54.61 | IC2.5 81.28,60.96 78.74,58.42 76.2,58.42
CS1  (via drill 0.6 pad 1.02)
  Top 0.406: v62.23,60.96 57.15,66.04 43.18,66.04 39.37,62.23 U$4.P$10
  Top 0.61: JP3.13 JP4.13 AXOLOTICORE.PA2
  Bottom 0.406: AXOLOTICORE.PA2 90.17,55.24 87.63,52.7 70.48,52.7 v62.23,60.96
CS2  (via drill 0.6 pad 1.02)
  Top 0.406: v62.23,57.78 22.23,57.78 20.32,59.69 20.32,63.5 17.78,66.04 U$5.P$10
  Top 0.61: JP3.12 JP4.12 AXOLOTICORE.PA3
  Bottom 0.406: AXOLOTICORE.PA3 90.81,52.7 88.9,50.8 69.22,50.8 v62.23,57.78
GND  (via drill 0.6, 0.6 pad 1.27, 0.6 pad 1.42)
  other vias: 40.64,47.62 3.81,3.81 12.06,31.11 81.28,34.92
  pour Bottom (isolate 0.406): 0,99.99 0,0 99.99,0 99.99,99.99
  pour Top (isolate 0.406): 0,99.99 0,0 99.99,0 99.99,99.99
IN1
  Top 0.406: R15.2 JP5-AUDIO.4
IN2
  Top 0.406: R31.2 73.66,46.99 76.2,44.45 JP5-AUDIO.1
INL1
  Top 0.406: R38.2 JP-CV.4
INL2  (via drill 0.6 pad 1.02)
  Top 0.406: v19.68,43.81 12.06,43.81 6.35,38.1 JP-CV.3
  Bottom 0.406: v19.68,43.81 23.5,43.81 25.4,41.91 R21.2
INL3  (via drill 0.6 pad 1.02)
  Top 0.406: v9.53,1.91 56.52,1.91 58.42,3.81 R18.2
  Bottom 0.406: v9.53,1.91 7.62,3.81 7.62,24.77 4.45,27.94 JP-CV.7
INL4
  Top 0.406: R7.2 45.09,5.71 43.18,3.81 10.16,3.81 5.08,8.89 5.08,29.21 3.81,30.48 JP-CV.6
INL5
  Top 0.406: R10.2 47.62,41.27 42.55,46.35 12.06,46.35 6.35,40.64 JP-CV.2
INL6
  Top 0.406: R27.2 59.69,41.91 57.78,43.81 47.62,43.81 42.55,48.9 10.79,48.9 5.08,43.18 JP-CV.1
INL7
  Bottom 0.406: JP-CV.8 R24.2
INL8  (via drill 0.6 pad 1.02)
  Top 0.406: v10.16,12.7 8.89,13.97 8.89,21.59 6.35,24.13 6.35,30.48 3.81,33.02 JP-CV.5
  Bottom 0.406: v10.16,12.7 13.97,12.7 15.24,11.43 24.13,11.43 25.4,10.16 R39.2
LIN+
  Bottom 0.406: AXOLOTICORE.LIN+ 74.93,14.61 74.68,14.86 C22.+
MISO  (via drill 0.6 pad 1.02)
  Top 0.406: U$5.P$12 17.78,71.12 19.05,69.85 v26.67,69.85 | v39.37,66.04 v34.29,66.04
  Top 0.61: AXOLOTICORE.PA6 JP4.7 JP3.7
  Bottom 0.406: v26.67,69.85 31.11,69.85 34.29,66.67 v34.29,66.04 U$4.P$12 | AXOLOTICORE.PA6 74.3,40.01 53.34,60.96 47.62,60.96 42.55,66.04 v39.37,66.04
MOSI
  Top 0.61: JP3.6 JP4.6 AXOLOTICORE.PA7
  Bottom 0.406: U$5.P$11 20.32,68.58 24.77,73.03 31.11,73.03 36.83,67.31 U$4.P$11 36.83,59.69 39.37,57.15 54.61,57.15 74.3,37.47 AXOLOTICORE.PA7
N$1
  Top 1.016: D1.C L2.2
N$2
  Top 0.406: IC4.9 26.67,30.48 25.4,31.75 R21.1 R22.1 | R25.2 29.84,40.64 30.48,40.64 C10.1
  Bottom 0.406: R25.2 27.94,36.83 25.4,34.29 R21.1
N$3
  Bottom 1.016: D2.A L1.2
N$4
  Top 0.406: R2.2 R3.3
N$5
  Top 0.406: C11.1 12.06,6.99 R24.1 14.61,6.99 R26.2 15.24,8.89 17.78,11.43 R23.1 17.78,16.51 16.51,17.78 IC4.2
N$6
  Top 0.406: IC2.13 73.66,76.2 71.75,78.11 R2.1 66.04,78.11 R1.2
N$7
  Top 0.406: R4.2 71.75,22.23 71.75,41.27 64.77,48.26 R1.1
  Bottom 0.406: R1.1 64.77,71.12 68.58,74.93 IC2.14
N$8
  Bottom 0.406: C22.- R32.2
N$9
  Bottom 0.406: R11.3 83.82,92.71 R6.2
N$10
  Top 0.406: R5.2 87.63,85.09 83.82,81.28 R6.1
  Bottom 0.406: IC2.9 R6.1
N$11
  Top 0.406: C20.1 12.7,40.64 R34.2 14.61,38.73 18.41,34.92 R36.1 18.41,32.38 16.51,30.48 IC4.13 16.51,25.4 15.24,24.13 12.7,24.13 R38.1
N$12
  Bottom 0.406: R5.1 86.36,78.11 IC2.8 88.9,72.39 88.9,62.23 85.72,59.05 83.19,59.05 R12.2
N$13
  Top 0.61: JP1-AU_FROM_AXO.1 76.83,87 81.28,82.55 IC2.10
N$14
  Top 0.61: JP1-AU_FROM_AXO.2 71.12,84.45 76.2,79.38 IC2.12
N$15
  Top 0.406: C21.1 29.21,15.24 R35.2 R39.1 R37.1
  Bottom 0.406: IC4.6 26.67,19.05 27.94,17.78 R35.2
N$16
  Bottom 0.406: R33.2 83.82,3.17 C24.-
N$17
  Top 0.406: R14.2 R15.1 IC2.6
N$18
  Top 0.406: C9.1 40.01,15.88 R8.2 R7.1 | IC3.2 50.8,17.78 47.62,14.61 R9.1
  Bottom 0.406: R7.1 46.35,15.88 46.99,15.24 | 46.99,15.24 | R9.1 46.99,15.24
N$19  (via drill 0.6 pad 1.02)
  Top 0.406: IC2.7 R14.1 88.9,60.96 v88.9,11.43
  Bottom 0.406: v88.9,11.43 86.36,8.89 79.38,8.89 R32.3
N$20
  Top 0.406: IC3.13 50.8,32.38 R17.1 R10.1 | C15.1 R13.2
  Bottom 0.406: R13.2 45.09,37.47 47.62,34.92 R10.1
N$21
  Top 0.406: R16.2 R31.1
  Bottom 0.406: IC2.2 R31.1
N$22
  Top 0.406: R20.1 | R20.1 56.52,15.88 R18.1 R19.2 | R19.2 64.14,15.88 C17.1 | R19.2 IC3.6
N$23
  Top 0.406: IC2.1 R16.1 71.12,62.23 81.28,52.07 84.45,52.07 86.36,49.53 R33.3
N$24
  Top 0.406: IC3.9 60.96,30.48 59.69,31.75 R27.1 59.69,35.56 63.5,39.37 R28.2
  Bottom 0.406: R29.1 R27.1 | C18.1 66.04,38.1 R28.2
N$26
  Top 0.61: JP3.4 JP4.4 AXOLOTICORE.PB1
N$27
  Top 0.61: AXOLOTICORE.PB0 JP4.5 JP3.5
N$29
  Top 0.61: JP3.2 JP4.2 AXOLOTICORE.VDDC
N$32
  Top 0.61: JP3.10 JP4.10 AXOLOTICORE.VDDA1
N$36
  Top 0.61: JP3.14 JP4.14 AXOLOTICORE.PA1
N$37
  Top 0.61: AXOLOTICORE.PA0 JP4.15 JP3.15
N$38
  Top 0.61: JP3.16 JP4.16 AXOLOTICORE.VDDA
N$40
  Top 0.61: AXOLOTICORE.PC5 JP4.18 JP3.18
N$41
  Top 0.61: JP3.19 JP4.19 AXOLOTICORE.PC4
N$42
  Top 0.61: AXOLOTICORE.PC3 JP4.20 JP3.20
N$43
  Top 0.61: JP3.21 JP4.21 AXOLOTICORE.PC2
N$44
  Top 0.61: AXOLOTICORE.PC1 JP4.22 JP3.22
N$45
  Top 0.61: JP3.23 JP4.23 AXOLOTICORE.PC0
N$48
  Top 0.61: JP3.26 JP4.26 AXOLOTICORE.PB9
N$49
  Top 0.61: AXOLOTICORE.PB8 JP4.27 JP3.27
N$50
  Top 0.61: JP3.28 JP4.28 AXOLOTICORE.PB7
N$51
  Top 0.61: AXOLOTICORE.PB6 JP4.29 JP3.29
N$56
  Top 0.813: SV1.9 SV1.10
  Top 1.016: SV1.10 D1.A
N$64
  Bottom 1.016: SV1.1 SV1.2 15.24,87.63 D2.C
NSS
  Top 0.61: AXOLOTICORE.PA4 JP4.9 JP3.9
OUT1
  Top 0.406: R4.1 81.28,20.95 81.28,22.86 JP5-AUDIO.3
OUT2
  Top 0.406: R12.1 78.74,44.45 JP5-AUDIO.2
RIN+
  Bottom 0.406: AXOLOTICORE.RIN+ 93.34,9.53 95.25,7.62 95.25,5.08 93.34,3.17 C24.+
SCK  (via drill 0.6 pad 1.02)
  Top 0.406: U$5.P$13 18.41,73.66 19.05,73.03 27.3,73.03 31.75,68.58 | 31.75,68.58 U$4.P$13 | v48.26,68.58 31.75,68.58
  Top 0.61: JP3.8 JP4.8 AXOLOTICORE.PA5
  Bottom 0.406: AXOLOTICORE.PA5 74.3,42.55 v48.26,68.58
VBUS
  Top 0.61: R40.2 D4.C R41.1 63.5,93.98 C25.1 68.58,98.42 AXOLOTICORE.VBUS
VCC
  Top 0.61: IC2.4 78.74,69.85 76.83,71.75 JP1.1 49.53,76.2 R40.1
  Top 0.813: R40.1 36.2,81.92 33.66,84.45 IC1.IN 33.66,88.9 31.37,91.19 C1.+ C2.+ 19.68,93.09 L2.1
  Bottom 0.61: IC2.4 C6.1
VDD
  Top 0.61: U$4.P$15 U$4.P$16 | AXOLOTICORE.VDD1 JP4.24 JP3.24 | U$5.P$15 19.05,78.74 C12.1 | JP_POT.1 8.89,86.36 13.97,81.28 U$5.P$16
  Bottom 0.61: AXOLOTICORE.VDD1 76.83,83.19 74.93,81.28 62.87,81.28 58.04,76.45 25.15,76.45 24.51,77.09 C8.+ C12.1 | U$5.P$16 U$5.P$15 15.24,78.74 12.7,76.2 12.7,63.5 15.24,60.96 U$4.P$16 | C5.1 C14.+ 26.42,61.21 U$4.P$15
VDD+
  Top 0.61: JP3.30 JP4.30 AXOLOTICORE.VDD
VEE  (via drill 0.7 pad 1.27)
  Top 0.61: R30.1 v56.52,63.5
  Top 0.813: C7.2 IC2.11 | L1.1 38.1,73.91 C13.-
  Bottom 0.61: v56.52,63.5 66.04,63.5 67.94,65.41 67.94,68.58 69.85,70.48 76.83,70.48 78.74,72.39 IC2.11
  Bottom 0.813: R30.1 39.37,73.66 C13.-

### Text on the board
tNames: 3,3V | GND | IC5 | 0 | 1 | 2 | 3 | 4 | 5 | 6 | 7 | ch: | IC6 | 6 | 5 | 2 | 0 | 3 | 4 | in1 | out1 | out2 | in2 | 7 | 1 | ch:
bNames: +12V | GND | EUXOLOTI | CORE | PCB Version 1.0 | AXOLOTI CORE | created by Paul 2015 | www.irieelectronics.de | CC-BY-NC-SA